# EAGLE design Motor_Driver_New_v21 (EAGLE 9.7.0)
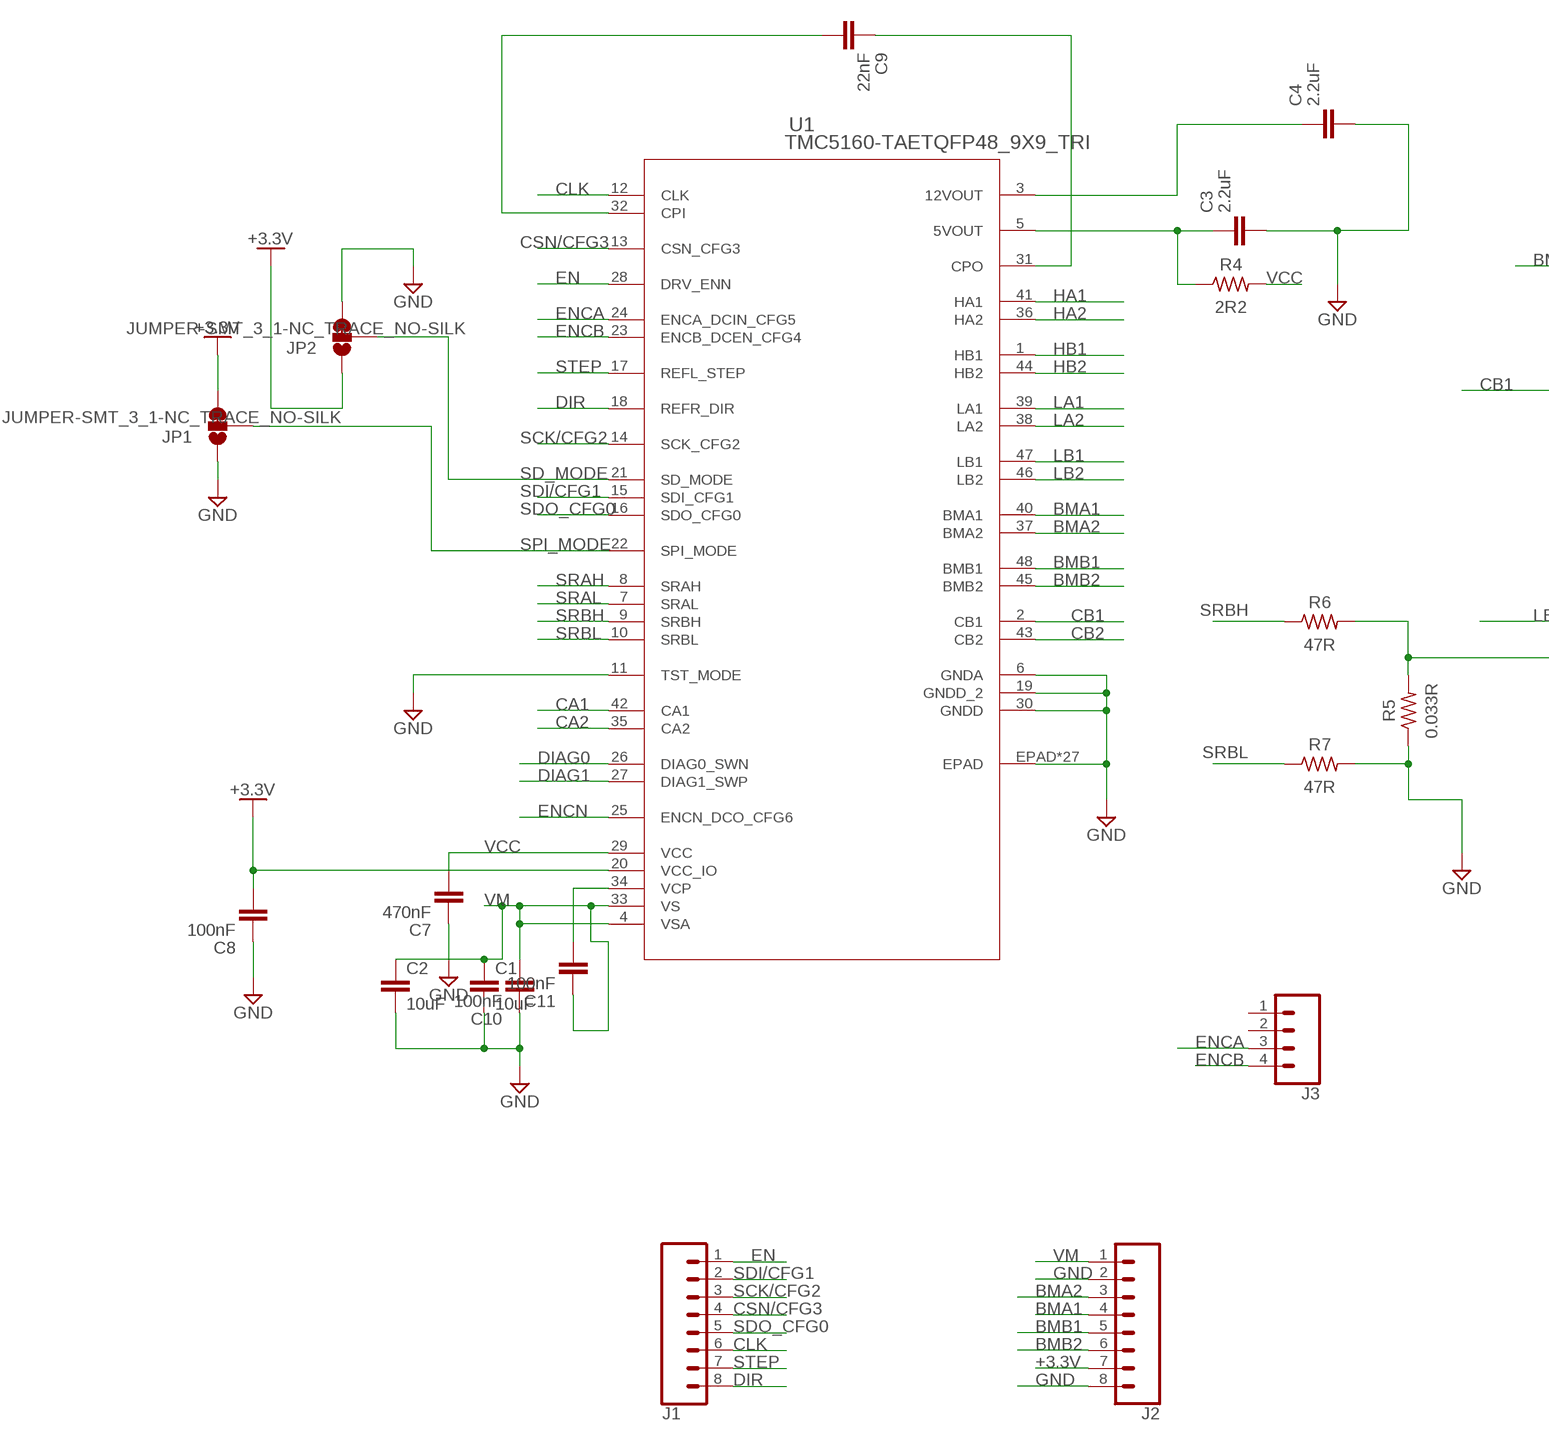
[diagram p0: schematic, sheet 1, part 1 of 2]
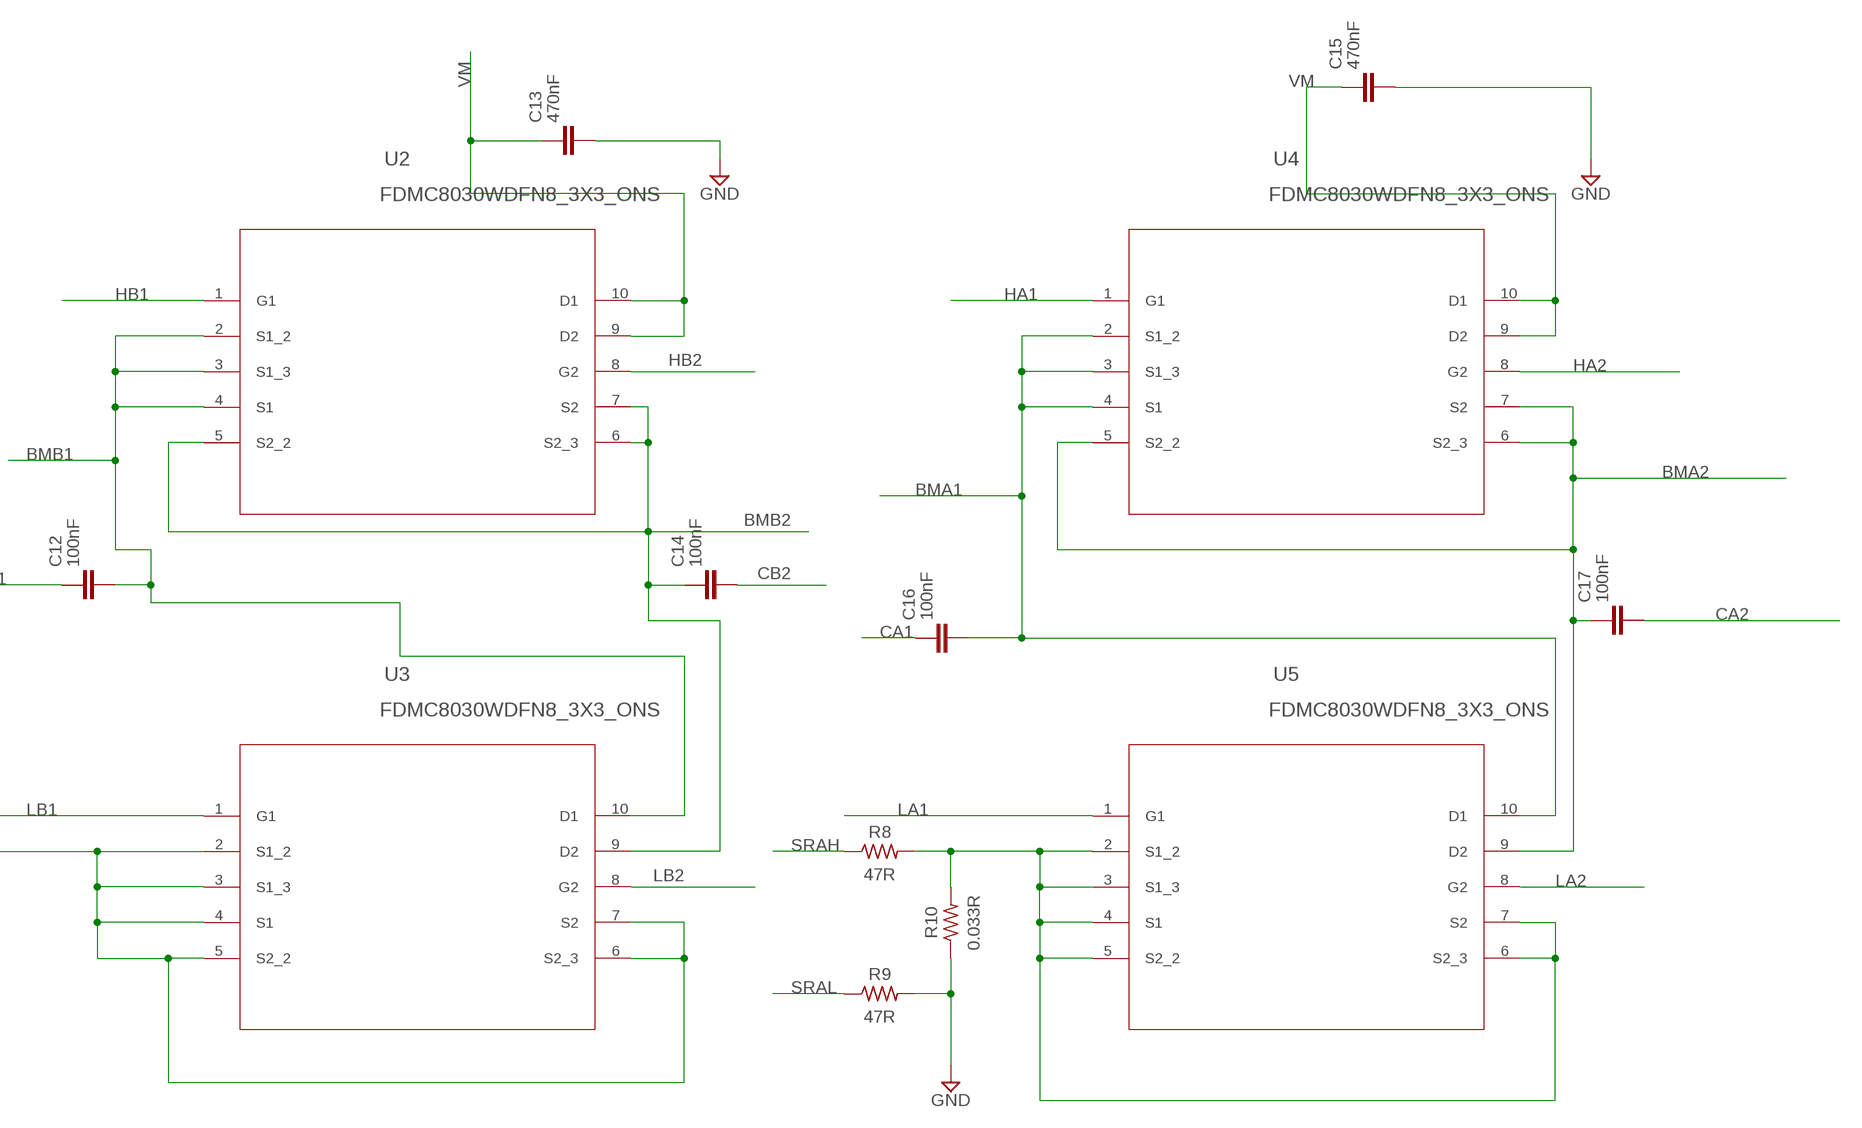
[diagram p1: schematic, sheet 1, part 2 of 2]

## Parts
C1  10uF  10UF-0805-25V-10%  [0805]
C2  10uF  10UF-0805-25V-10%  [0805]
C3  2.2uF  C_CHIP-0402(1005-METRIC)  [CAPC1005X60]
C4  2.2uF  C_CHIP-0402(1005-METRIC)  [CAPC1005X60]
C7  470nF  C_CHIP-0402(1005-METRIC)  [CAPC1005X60]
C8  100nF  C_CHIP-0402(1005-METRIC)  [CAPC1005X60]
C9  22nF  C_CHIP-0402(1005-METRIC)  [CAPC1005X60]
C10  100nF  C_CHIP-0402(1005-METRIC)  [CAPC1005X60]
C11  100nF  C_CHIP-0402(1005-METRIC)  [CAPC1005X60]
C12  100nF  C_CHIP-0402(1005-METRIC)  [CAPC1005X60]
C13  470nF  C_CHIP-0402(1005-METRIC)  [CAPC1005X60]
C14  100nF  C_CHIP-0402(1005-METRIC)  [CAPC1005X60]
C15  470nF  C_CHIP-0402(1005-METRIC)  [CAPC1005X60]
C16  100nF  C_CHIP-0402(1005-METRIC)  [CAPC1005X60]
C17  100nF  C_CHIP-0402(1005-METRIC)  [CAPC1005X60]
J1  CONN_08"  [1X08]
J2  CONN_08"  [1X08]
J3  CONN_04PTH  [1X04]
JP1  JUMPER-SMT_3_1-NC_TRACE_NO-SILK  [SMT-JUMPER_3_1-NC_TRACE_NO-SILK]
JP2  JUMPER-SMT_3_1-NC_TRACE_NO-SILK  [SMT-JUMPER_3_1-NC_TRACE_NO-SILK]
R4  2R2  R-US_CHIP-0402(1005-METRIC)  [RESC1005X40]
R5  0.033R  R-US_CHIP-1206(3216-METRIC)  [RESC3216X70]
R6  47R  R-US_CHIP-0402(1005-METRIC)  [RESC1005X40]
R7  47R  R-US_CHIP-0402(1005-METRIC)  [RESC1005X40]
R8  47R  R-US_CHIP-0402(1005-METRIC)  [RESC1005X40]
R9  47R  R-US_CHIP-0402(1005-METRIC)  [RESC1005X40]
R10  0.033R  R-US_CHIP-1206(3216-METRIC)  [RESC3216X70]
U1  TMC5160-TAETQFP48_9X9_TRI  [ETQFP48_9X9_TRI]
U2  FDMC8030WDFN8_3X3_ONS  [WDFN8_3X3_ONS]
U3  FDMC8030WDFN8_3X3_ONS  [WDFN8_3X3_ONS]
U4  FDMC8030WDFN8_3X3_ONS  [WDFN8_3X3_ONS]
U5  FDMC8030WDFN8_3X3_ONS  [WDFN8_3X3_ONS]

## Nets
+3.3V: C8.2 J2.7 JP1.3 JP2.1 U1.20(VCC_IO)
BMA1: C16.2 J2.4 U1.40(BMA1) U4.2(S1_2) U4.3(S1_3) U4.4(S1) U5.10(D1)
BMA2: C17.1 J2.3 U1.37(BMA2) U4.5(S2_2) U4.6(S2_3) U4.7(S2) U5.9(D2)
BMB1: C12.2 J2.5 U1.48(BMB1) U2.2(S1_2) U2.3(S1_3) U2.4(S1) U3.10(D1)
BMB2: C14.1 J2.6 U1.45(BMB2) U2.5(S2_2) U2.6(S2_3) U2.7(S2) U3.9(D2)
CA1: C16.1 U1.42(CA1)
CA2: C17.2 U1.35(CA2)
CB1: C12.1 U1.2(CB1)
CB2: C14.2 U1.43(CB2)
CLK: J1.6 U1.12(CLK)
CSN/CFG3: J1.4 U1.13(CSN_CFG3)
DIAG0: U1.26(DIAG0_SWN)
DIAG1: U1.27(DIAG1_SWP)
DIR: J1.8 U1.18(REFR_DIR)
EN: J1.1 U1.28(DRV_ENN)
ENCA: J3.3 U1.24(ENCA_DCIN_CFG5)
ENCB: J3.4 U1.23(ENCB_DCEN_CFG4)
ENCN: U1.25(ENCN_DCO_CFG6)
GND: C1.2 C2.2 C3.2 C4.2 C7.1 C8.1 C10.1 C13.2 C15.2 J2.2 J2.8 JP1.1 JP2.3 R5.1 R7.2 R9.2 R10.1 U1.6(GNDA) U1.11(TST_MODE) U1.19(GNDD_2) U1.30(GNDD) U1.EPAD U1.EPAD1(EPAD) U1.P$1(EPAD) U1.P$2(EPAD) U1.P$3(EPAD) U1.P$4(EPAD) U1.P$5(EPAD) U1.P$6(EPAD) U1.P$7(EPAD) U1.P$8(EPAD) U1.P$9(EPAD) U1.P$10(EPAD) U1.P$11(EPAD) U1.P$12(EPAD) U1.P$13(EPAD) U1.P$14(EPAD) U1.P$15(EPAD) U1.P$16(EPAD) U1.P$17(EPAD) U1.P$18(EPAD) U1.P$19(EPAD) U1.P$20(EPAD) U1.P$21(EPAD) U1.P$22(EPAD) U1.P$23(EPAD) U1.P$24(EPAD) U1.P$25(EPAD)
HA1: U1.41(HA1) U4.1(G1)
HA2: U1.36(HA2) U4.8(G2)
HB1: U1.1(HB1) U2.1(G1)
HB2: U1.44(HB2) U2.8(G2)
LA1: U1.39(LA1) U5.1(G1)
LA2: U1.38(LA2) U5.8(G2)
LB1: U1.47(LB1) U3.1(G1)
LB2: U1.46(LB2) U3.8(G2)
N$1: C3.1 R4.1 U1.5(5VOUT)
N$2: C4.1 U1.3(12VOUT)
N$3: C9.2 U1.32(CPI)
N$4: C9.1 U1.31(CPO)
N$6: C11.2 U1.34(VCP)
SCK/CFG2: J1.3 U1.14(SCK_CFG2)
SD_MODE: JP2.2 U1.21(SD_MODE)
SDI/CFG1: J1.2 U1.15(SDI_CFG1)
SDO_CFG0: J1.5 U1.16(SDO_CFG0)
SPI_MODE: JP1.2 U1.22(SPI_MODE)
SRAH: R8.1 U1.8(SRAH)
SRAHL: R8.2 R10.2 U5.2(S1_2) U5.3(S1_3) U5.4(S1) U5.5(S2_2) U5.6(S2_3) U5.7(S2)
SRAL: R9.1 U1.7(SRAL)
SRBH: R6.1 U1.9(SRBH)
SRBHL: R5.2 R6.2 U3.2(S1_2) U3.3(S1_3) U3.4(S1) U3.5(S2_2) U3.6(S2_3) U3.7(S2)
SRBL: R7.1 U1.10(SRBL)
STEP: J1.7 U1.17(REFL_STEP)
VCC: C7.2 R4.2 U1.29(VCC)
VM: C1.1 C2.1 C10.2 C11.1 C13.1 C15.1 J2.1 U1.4(VSA) U1.33(VS) U2.9(D2) U2.10(D1) U4.9(D2) U4.10(D1)
Unconnected: J3.1 J3.2

## Library data of the parts
C1 C2 = SparkFun-Capacitors:10UF: 10.0µF ceramic capacitors A capacitor is a passive two-terminal electrical component used to store electrical energy temporarily in an electric field.; PROD_ID: CAP-14259
C3 C4 C7-C17 = Capacitor:C: Capacitor - Generic; CATEGORY: Capacitor
J1 J2 = SparkFun-Connectors:CONN_08: Multi connection point. Often used as Generic Header-pin footprint for 0.1 inch spaced/style header connections On any of the 0.1 inch spaced packages, you can populate with these: Break Away Headers - Straight <https://www.sparkfun.com/products/116> (PRT-00116) Break Away Male Headers - Right Angle <https://www.sparkfun.com/products/553> (PRT-00553) Female Headers <https://www.sparkfun.com/products/115> (PRT-00115) Break Away Headers - Machine Pin <https://www.sparkfun.com/products/117> (PRT-00117) Break Away Female Headers - Swiss Machine Pin <https://www.sparkfun.com/products/743> (PRT-00743) Arduino Stackable Header - 8 Pin <https://www.sparkfun.com/products/9279> (PRT-09279) For SCREWTERMINALS and SPRING TERMINALS visit here: Screw Terimnals on SparkFun.com <https://www.sparkfun.com/search/results?term=Screw+Terminals> (5mm/3.5mm/2.54mm spacing) This device is also useful as a general connection point to wire up your design to another part of your project. Our various solder wires solder well into these plated through hole pads. Hook-Up Wire - Assortment (Stranded, 22 AWG) <https://www.sparkfun.com/products/11375> (PRT-11375) Hook-Up Wire - Assortment (Solid Core, 22 AWG) <https://www.sparkfun.com/products/11367> (PRT-11367) View the entire wire category on our website here <https://www.sparkfun.com/categories/141> Special notes: Molex polarized connector foot print use with SKU : PRT-08231 with associated crimp pins and housings. 1MM SMD Version SKU: PRT-10208 NOTES ON THE VARIANTS LOCK and LOCK_LONGPADS... This footprint was designed to help hold the alignment of a through-hole component (i.e. 6-pin header) while soldering it into place. You may notice that each hole has been shifted either up or down by 0.005 of an inch from it's more standard position (which is a perfectly straight line). This slight alteration caused the pins (the squares in the middle) to touch the edges of the holes. Because they are alternating, it causes a "brace" to hold the component in place. 0.005 has proven to be the perfect amount of "off-center" position when using our standard breakaway headers. Although looks a little odd when you look at the bare footprint, once you have a header in there, the alteration is very hard to notice. Also,if you push a header all the way into place, it is covered up entirely on the bottom side.; PROD_ID: CONN-08438
J3 = SparkFun-Connectors:CONN_04: Multi connection point. Often used as Generic Header-pin footprint for 0.1 inch spaced/style header connections On any of the 0.1 inch spaced packages, you can populate with these: Break Away Headers - Straight <https://www.sparkfun.com/products/116> (PRT-00116) Break Away Male Headers - Right Angle <https://www.sparkfun.com/products/553> (PRT-00553) Female Headers <https://www.sparkfun.com/products/115> (PRT-00115) Break Away Headers - Machine Pin <https://www.sparkfun.com/products/117> (PRT-00117) Break Away Female Headers - Swiss Machine Pin <https://www.sparkfun.com/products/743> (PRT-00743) For SCREWTERMINALS and SPRING TERMINALS visit here: Screw Terimnals on SparkFun.com <https://www.sparkfun.com/search/results?term=Screw+Terminals> (5mm/3.5mm/2.54mm spacing) This device is also useful as a general connection point to wire up your design to another part of your project. Our various solder wires solder well into these plated through hole pads. Hook-Up Wire - Assortment (Stranded, 22 AWG) <https://www.sparkfun.com/products/11375> (PRT-11375) Hook-Up Wire - Assortment (Solid Core, 22 AWG) <https://www.sparkfun.com/products/11367> (PRT-11367) View the entire wire category on our website here <https://www.sparkfun.com/categories/141> Special notes: Molex polarized connector foot print use with SKU : PRT-08231 with associated crimp pins and housings. 1MM SMD Version SKU: PRT-10208; PROD_ID: CONN-09696
JP1 JP2 = SparkFun-Jumpers:JUMPER-SMT_3_1-NC_TRACE: Normally closed trace jumper (1 of 2 connections) This jumper has a trace between two pads so it's normally closed (NC). The other connection is normally open (NO). Use a razor knife to open the connection. For best results follow the IPC guidelines for cutting traces: Cutout at least 0.063 mm (0.005 in). Remove all loose material to clean up the cut area. Seal the cut with an approved epoxy. Reapply solder to reclose the connection, or to close the NO connection.
R4-R10 = Resistor:R-US: Resistor Fixed - ANSI; CATEGORY: Resistor; SUB-CATEGORY: Fixed
U1 = Library:TMC5160-TA; COPYRIGHT: Copyright (C) 2023 Ultra Librarian. All rights reserved.; MANUFACTURER_PART_NUMBER: TMC5160-TA; MFR_NAME: Analog Devices Inc
U2-U5 = fdmc8030lib:FDMC8030; COPYRIGHT: Copyright (C) 2023 Ultra Librarian. All rights reserved.; MANUFACTURER_PART_NUMBER: FDMC8030; MFR_NAME: onsemi

## Board
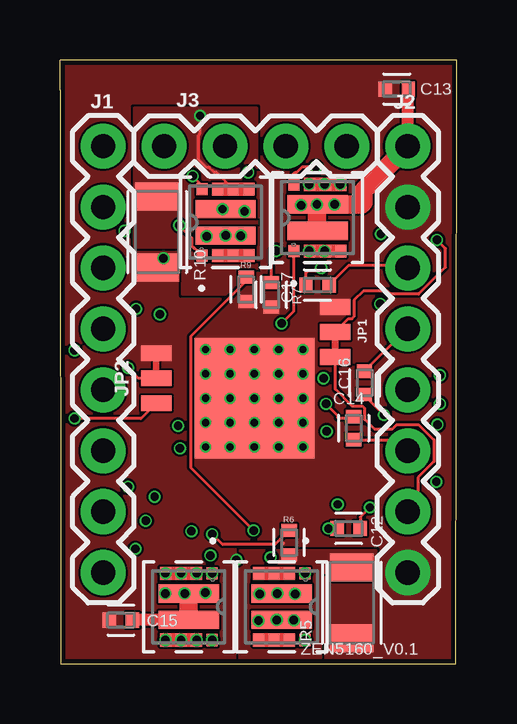
[diagram p2: board, top side]
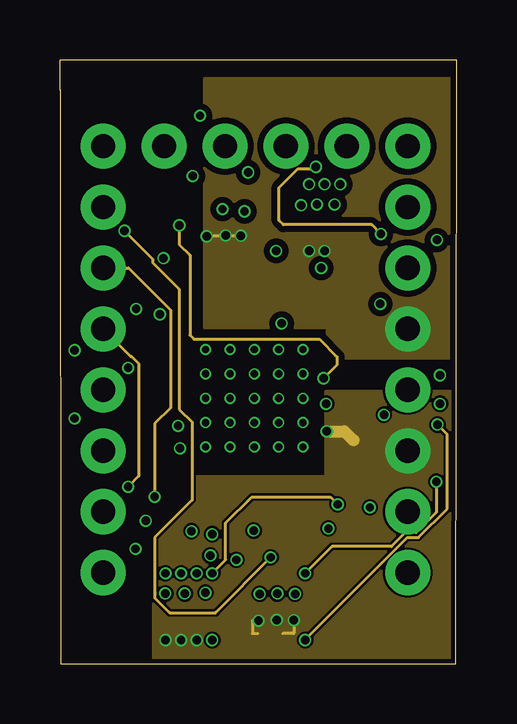
[diagram p3: board, inner layer Route2]
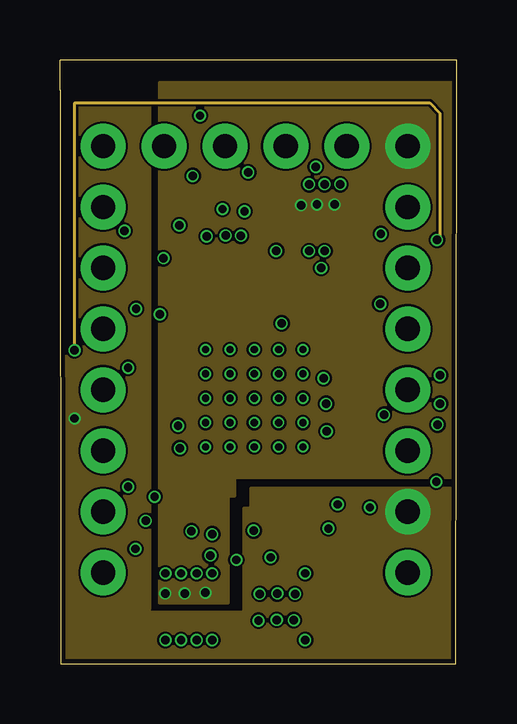
[diagram p4: board, inner layer Route3]
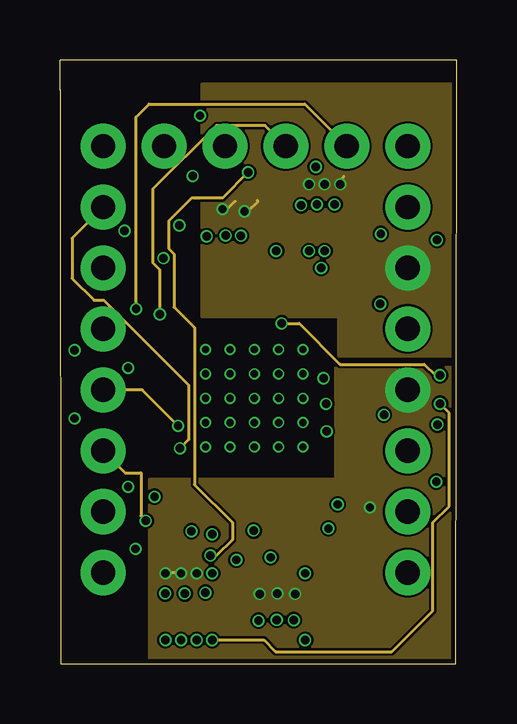
[diagram p5: board, inner layer Route14]
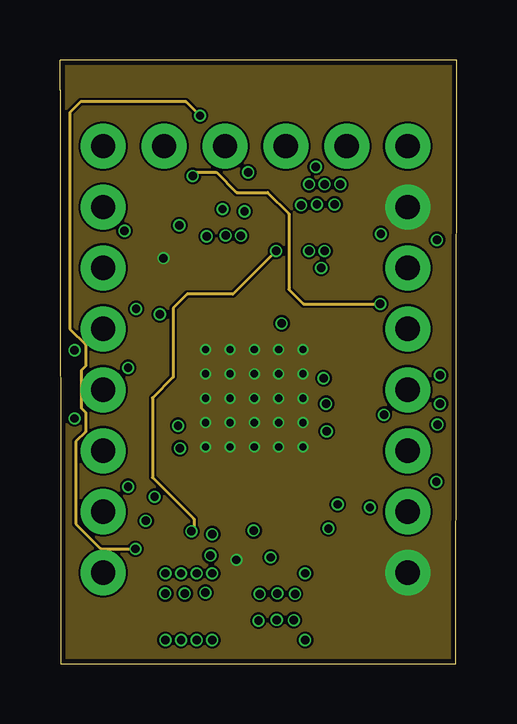
[diagram p6: board, inner layer Route15]
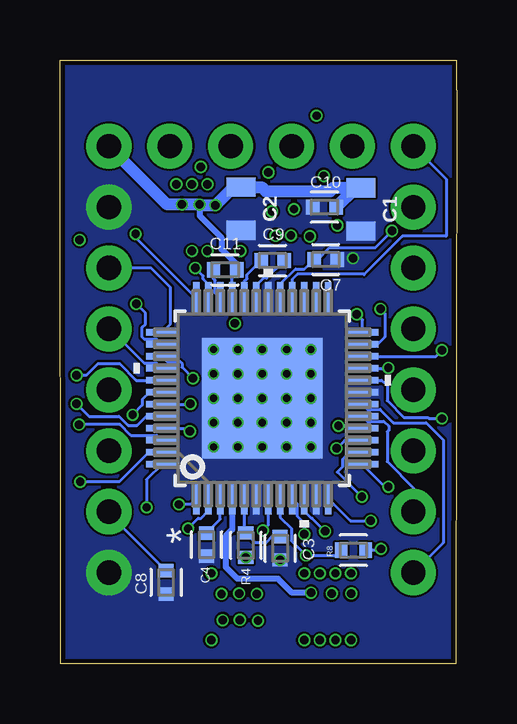
[diagram p7: board, bottom side, seen from below]

Size 16.54 x 25.18 mm. Coordinates in mm from the lower left corner, seen from the top.
Outline: 0.03,0 16.52,0 16.54,23.91 16.54,25.18 0,25.18 0,23.91 0.03,0
Copper layers (1+2*3+14*15+16): Top 0.035mm / dielectric 0.1mm / Route2 0.0175mm / dielectric 0.565mm / Route3 0.0175mm / dielectric 5mil / Route14 0.0356mm / dielectric 0.1499mm / Route15 0.01778125mm / dielectric 0.17018125mm / Bottom 0.035mm
Design rules "jlcpcb-6-layer *": minimum track width 3.5mil, minimum drill 0.2mm, track to track 3.5mil, track to pad 3.5mil, pad to pad 3.5mil, via to via 5mil, smd to smd 0mil, copper to edge 0.2mm, drill to drill 5mil, minimum pad ring 3mil, minimum via ring 3mil, stop-mask expansion 0mil, vias tented up to drill 100mil, thermal gap 10mil

### Footprints (pad centres in the part's own frame; a part is rotated, then mirrored left to right if it is on the bottom)
0805 = smd 0.8 x 1.2: 1 -0.9,0; 2 0.9,0
CAPC1005X60 = smd 0.56 x 0.629: 1 -0.485,0; 2 0.485,0
1X08 = drill 1.016 pad 1.88: 1 0,0; 2 2.54,0; 3 5.08,0; 4 7.62,0; 5 10.16,0; 6 12.7,0; 7 15.24,0; 8 17.78,0
1X04 = drill 1.016 pad 1.88: 1 0,0; 2 2.54,0; 3 5.08,0; 4 7.62,0
SMT-JUMPER_3_1-NC_TRACE_NO-SILK = smd 0.66 x 1.27: 1 -1.041,0; 2 0,0; 3 1.041,0
RESC1005X40 = smd 0.535 x 0.644: 1 -0.507,0; 2 0.507,0
RESC3216X70 = smd 1.165 x 1.815: 1 -1.475,0; 2 1.475,0
ETQFP48_9X9_TRI = smd 1.346 x 0.279: 1 -4.178,2.75; 2 -4.178,2.25; 3 -4.178,1.75; 4 -4.178,1.25; 5 -4.178,0.75; 6 -4.178,0.25; 7 -4.178,-0.25; 8 -4.178,-0.75; 9 -4.178,-1.25; 10 -4.178,-1.75; 11 -4.178,-2.25; 12 -4.178,-2.75; 25 4.178,-2.75; 26 4.178,-2.25; 27 4.178,-1.75; 28 4.178,-1.25; 29 4.178,-0.75; 30 4.178,-0.25; 31 4.178,0.25; 32 4.178,0.75; 33 4.178,1.25; 34 4.178,1.75; 35 4.178,2.25; 36 4.178,2.75 | smd 0.279 x 1.346: 13 -2.75,-4.178; 14 -2.25,-4.178; 15 -1.75,-4.178; 16 -1.25,-4.178; 17 -0.75,-4.178; 18 -0.25,-4.178; 19 0.25,-4.178; 20 0.75,-4.178; 21 1.25,-4.178; 22 1.75,-4.178; 23 2.25,-4.178; 24 2.75,-4.178; 37 2.75,4.178; 38 2.25,4.178; 39 1.75,4.178; 40 1.25,4.178; 41 0.75,4.178; 42 0.25,4.178; 43 -0.25,4.178; 44 -0.75,4.178; 45 -1.25,4.178; 46 -1.75,4.178; 47 -2.25,4.178; 48 -2.75,4.178 | smd 5.004 x 5.004: EPAD 0,0 | smd 5.004 x 5.004 bottom: EPAD1 0,0 | drill 0.305: P$1 -2.032,2.032; P$2 -1.016,2.032; P$3 0,2.032; P$4 1.016,2.032; P$5 2.032,2.032; P$6 -2.032,1.016; P$7 -2.032,0; P$8 -2.032,-1.016; P$9 -2.032,-2.032; P$10 -1.016,1.016; P$11 -1.016,0; P$12 -1.016,-1.016; P$13 -1.016,-2.032; P$14 0,1.016; P$15 0,0; P$16 0,-1.016; P$17 0,-2.032; P$18 1.016,1.016; P$19 1.016,0; P$20 1.016,-1.016; P$21 1.016,-2.032; P$22 2.032,1.016; P$23 2.032,0; P$24 2.032,-1.016; P$25 2.032,-2.032
WDFN8_3X3_ONS = smd 0.508 x 0.457: 1 -1.39,0.98; 2 -1.39,0.33; 3 -1.39,-0.32; 4 -1.39,-0.97; 5 1.39,-0.97; 6 1.39,-0.32; 7 1.39,0.33; 8 1.39,0.98 | smd 0.762 x 2.515: 9 0.55,0; 10 -0.55,0

### Placement (x,y rotation side)
C1  3.99,18.95 270 bottom
C2  8.99,18.98 270 bottom
C3  7.36,4.83 270 bottom
C4  10.43,4.98 270 bottom
C7  5.46,16.87 180 bottom
C8  12.12,3.4 90 bottom
C9  7.67,16.82 180 bottom
C10  5.51,19.05 0 bottom
C11  9.65,16.43 180 bottom
C12  12.04,5.65 0 top
C13  14.05,23.97 180 top
C14  12.25,9.83 90 top
C15  2.54,1.83 180 top
C16  12.7,11.72 90 top
C17  10.74,15.8 180 top
J1  1.8,21.59 270 top
J2  14.5,21.59 270 top
J3  4.34,21.59 0 top
JP1  11.48,13.84 270 top
JP2  4.01,11.91 90 top
R4  8.79,4.95 270 bottom
R5  12.16,2.55 90 top
R6  9.56,5.06 270 top
R7  8.81,15.39 270 top
R8  4.3,4.75 0 bottom
R9  7.76,15.62 270 top
R10  4.05,18.01 90 top
U1  8.11,11.08 90 bottom
U2  5.37,2.39 270 top
U3  9.25,2.39 270 top
U4  10.74,18.61 90 top
U5  6.91,18.41 90 top

### Tracks (layer width: path | path; a pad name or v marks a point on that pad's centre or on a via)
+3.3V  (via drill 0.35)
  Top 0.127: JP2.1 3.38,10.24 v0.61,10.24 | J2.7 14.94,6.78 14.94,7.78 15.6,8.44 15.6,9.34 14.96,9.98 14.05,9.98 13.87,9.8 13.11,9.8 12.72,10.19 12.72,10.66 12.63,10.75 12.19,10.75 11.48,11.46 JP1.3
  Route3 0.127: v0.61,10.24 0.53,10.16 0.41,10.16
  Bottom 0.127: U1.20 3.12,11.83 2.9,11.61 2.9,10.98 2.19,10.27 1.18,10.27 1.14,10.24 v0.61,10.24 | C8.2 14.5,6.28 J2.7
  pour Route3 (no thermals): 7.64,2.17 7.61,2.16 3.77,2.16 3.74,2.17 3.72,2.19 3.71,2.22 3.71,2.25 3.72,2.28 3.73,2.29 3.73,25.37 -0.76,25.37 -0.76,-1.27 16.89,-1.27 16.89,7.32 7.98,7.32 7.98,6.54 7.96,6.51 7.94,6.49 7.91,6.48 7.67,6.48 7.67,2.22 7.66,2.19
BMA1  (via drill 0.35)
  Top 0.127: U5.10 6.16,17.86 v6.12,17.83 | J2.4 14.47,13.97 C16.2
  Top 0.152: U4.2 v11.04,17.22 U4.4 | U4.3 v10.39,17.22
  Route2 0.127: v10.39,17.22 | U5.10 6.84,17.86 6.76,17.78 6.81,17.73 | U5.10 7.54,17.86 v7.54,17.86 | v6.12,17.83 6.87,17.83 U5.10
  Bottom 0.127: U1.40 12.49,12.54 13.02,12.54 14.45,13.97 J2.4
  other vias: 6.91,17.86
  pour Route2 (isolate 0.254, no thermals): 6.01,24.4 6.01,14.03 11.09,14.03 11.11,14.02 11.13,14.01 11.14,13.98 11.14,12.76 16.85,12.76 16.85,24.4
BMA2  (via drill 0.35)
  Top 0.127: U4.6 v11.69,20 | v7.7,18.87 7.6,18.96 U5.9 v6.78,18.96 | C17.1 12.04,16.61 14.4,16.61 J2.3
  Top 0.152: v10.39,20 v11.04,20 U4.6 | U4.7 U4.6 | U4.6 U4.5
  Route14 0.127: v11.69,20 11.69,20.17 11.84,20.32 | v6.78,18.96 v6.79,18.96 6.88,18.87 7.3,19.29 | v7.7,18.87 7.85,18.87 8.23,19.25 8.23,19.33
  Bottom 0.127: U1.37 11.94,14.18 11.94,15.7 12.75,16.51 J2.3
  pour Route14 (no thermals): 5.91,24.17 5.91,14.49 11.57,14.49 11.59,14.48 11.61,14.46 11.62,14.44 11.62,12.84 16.8,12.84 16.8,24.17
BMB1  (via drill 0.35)
  Top 0.127: v8.33,2.92 8.33,2.94 v9.07,2.94 U3.10 9.8,2.94 v9.8,2.92 | U2.4 U2.3 U2.2 | v12.93,6.53 12.52,6.12 C12.2
  Route14 0.127: U2.4 4.4,3.81 4.9,3.81 4.9,3.79
  Bottom 0.127: U1.48 12.93,7.68 v12.93,6.53
  other vias: 4.4,3.78 5.05,3.78 5.7,3.78
  pour Route14 (no thermals): 11.49,7.73 11.47,7.71 11.45,7.7 3.73,7.7 3.73,-1.19 16.84,-1.19 16.84,12.37 11.51,12.37 11.51,7.76
BMB2  (via drill 0.35)
  Top 0.127: v8.28,1.8 8.28,1.84 v9.04,1.84 U3.9 v9.75,1.84 v9.75,1.83 | U2.5 U2.6 U2.7 | C14.1 14.05,9.34 J2.6
  Route2 0.127: v8.28,1.8 8.03,1.8 8.03,1.27 8.26,1.27 | v9.75,1.83 9.75,1.27 9.3,1.27
  Route2 0.508: v11.13,9.7 11.86,9.7 12.24,9.32
  Bottom 0.127: U1.45 11.25,9.83 v11.13,9.7
  other vias: 4.4,1 5.05,1 5.7,1
  pour Route2 (no thermals): 11.09,7.83 11.07,7.81 11.04,7.8 3.91,7.8 3.91,-1.09 16.84,-1.09 16.84,11.35 11.1,11.35 11.1,7.86
CA1  (via drill 0.35)
  Top 0.127: v13.51,10.39 12.7,11.2 C16.1
  Bottom 0.127: v13.51,10.39 13.11,10.79 13.11,11.03 12.81,11.33 U1.42
CA2  (via drill 0.35)
  Top 0.127: v10.9,16.51 10.8,16.41 10.36,16.41 10.26,16.3 C17.2
  Bottom 0.127: v10.9,16.51 10.57,16.18 10.57,16.06 10.36,15.84 U1.35
CB1  (via drill 0.35)
  Top 0.152: C12.1 v11.2,5.65
  Bottom 0.127: v11.2,5.65 10.77,6.08 10.65,6.08 10.36,6.37 U1.2
CB2  (via drill 0.35)
  Top 0.127: v11.1,10.85 11.58,10.36 11.58,10.26 12.2,10.26 C14.2
  Bottom 0.127: U1.43 11.12,10.83 v11.1,10.85
CLK  (via drill 0.35)
  Route14 0.127: J1.6 2.72,7.98 3.38,7.98 3.38,6.17 v3.58,5.97
  Bottom 0.127: U1.12 4.43,5.97 v3.58,5.97
CSN/CFG3  (via drill 0.35)
  Route2 0.127: J1.4 2.95,12.83 2.99,12.83 3.29,12.53 3.29,7.83 v2.84,7.39
  Bottom 0.127: U1.13 2.99,7.39 v2.84,7.39
DIR
  Bottom 0.127: U1.18 3.72,10.62 3.19,10.62 2.63,10.06 1.27,10.06 0.56,9.35 0.56,5.05 J1.8
EN
  Bottom 0.127: U1.28 6.86,16.03 6.63,16.26 3.89,16.26 3.86,16.23 2.26,17.83 0.43,17.83 0.43,20.22 J1.1
ENCA  (via drill 0.35)
  Route14 0.127: v4.17,14.58 4.17,16.44 3.87,16.73 3.87,19.8 6.53,22.45 8.56,22.45 J3.3
  Bottom 0.127: U1.24 3.93,14.34 v4.17,14.58
ENCB  (via drill 0.35)
  Route14 0.127: v3.18,14.81 3.18,22.81 3.71,23.34 10.21,23.34 J3.4
  Bottom 0.127: U1.23 3.31,13.33 3,13.64 3,14.63 v3.18,14.81
GND  (via drill 0.35)
  Top 0.127: 9.33,5.04 9.31,5.01 | 4.18,16.43 4.32,16.57 v4.32,16.92
  other vias: 7.36,4.34
  pour Top (rank 5, no thermals): -0.8,-1.21 18.12,-1.21 18.12,25.34 -0.8,25.34
  pour Route15 (no thermals): -0.79,-1.19 18.11,-1.19 18.11,25.32 -0.79,25.32
  pour Bottom (no thermals): -0.8,-1.21 18.12,-1.21 18.12,25.34 -0.8,25.34
HA1  (via drill 0.35)
  Top 0.127: 9.74,17.22 9.74,14.69 v9.25,14.2
  Top 0.152: U4.1 9.74,17.22
  Route14 0.127: v9.25,14.2 9.98,14.2 11.68,12.5 15.19,12.5 15.65,12.04 v15.85,12.04
  Bottom 0.127: U1.41 13.36,11.83 14.05,12.52 14.96,12.52 15.44,12.04 v15.85,12.04
HA2  (via drill 0.35)
  Top 0.127: 9.74,20 9.74,20.43 9.8,20.5 9.88,20.5 10.1,20.73 v10.67,20.73
  Top 0.152: U4.8 9.74,20
  Route2 0.127: v13.39,17.93 13,18.31 9.32,18.31 9.14,18.49 9.14,19.86 9.93,20.65 10.59,20.65 v10.67,20.73
  Bottom 0.127: U1.36 13.39,17.79 v13.39,17.93
HB1  (via drill 0.35)
  Route2 0.127: v11.58,6.66 11.28,6.96 8,6.96 6.92,5.88 6.92,4.34 U2.1
  Bottom 0.127: U1.1 11.1,6.66 v11.58,6.66
  other vias: 6.35,3.78
HB2  (via drill 0.35)
  Route14 0.127: U2.8 8.5,1 8.99,0.51 13.84,0.51 15.54,2.21 15.54,5.89 16.23,6.58 16.23,10.46 v15.85,10.85
  Bottom 0.127: v15.85,10.85 15.33,10.33 14.08,10.33 13.7,9.95 13.33,9.95 12.95,10.33 U1.44
  other vias: 6.35,1
LA1  (via drill 0.35)
  Top 0.127: U5.1 5.62,17.33 5.59,17.33 5.5,17.42 5.5,17.77 v4.98,18.29
  Route2 0.127: v4.98,18.29 4.98,17.49 5.42,17.05 5.42,13.71 5.59,13.54 10.82,13.54 11.56,12.8 11.56,12.47 v11,11.91
  Bottom 0.127: U1.39 12.08,12.62 11.55,12.62 11.46,12.53 11.46,12.37 v11,11.91
LA2  (via drill 0.35)
  Top 0.127: U5.8 5.93,19.95 v5.54,20.34
  Route15 0.127: v13.36,15.01 10.16,15.01 9.55,15.62 9.55,18.77 8.66,19.66 7.37,19.66 6.53,20.5 5.69,20.5 v5.54,20.34
  Bottom 0.127: U1.38 12.49,13.54 13.02,13.54 13.11,13.63 13.11,14.03 12.98,14.16 12.98,14.63 v13.36,15.01
LB1  (via drill 0.35)
  Route2 0.127: U3.1 11.35,4.9 13.82,4.9 14.41,5.49 14.86,5.49 15.7,6.32 v15.7,7.59
  Bottom 0.127: U1.47 12.84,8.83 14.07,7.59 v15.7,7.59
  other vias: 10.23,3.78
LB2  (via drill 0.35)
  Route2 0.127: U3.8 14.5,5.27 14.95,5.27 16.15,6.47 16.15,9.58 v15.75,9.98
  Bottom 0.127: U1.46 12.49,9.54 13.59,9.54 14.04,9.98 v15.75,9.98
  other vias: 10.23,1
N$1
  Bottom 0.127: U1.5 8.86,5.53 R4.1 8.41,5.08 7.92,5.08 7.69,5.31 C3.1
N$2
  Bottom 0.127: U1.3 9.86,6.03 C4.1
N$3
  Bottom 0.127: C9.2 8.74,16.24 8.74,16.06 8.86,15.94 U1.32
N$4
  Bottom 0.127: C9.1 7.93,16.08 8.06,16.08 8.36,15.79 U1.31
N$6
  Bottom 0.127: C11.2 10.14,16.07 10.06,15.99 10.06,15.46 U1.34
SCK/CFG2  (via drill 0.35)
  Route2 0.127: v3.95,6.97 3.95,10.02 4.61,10.68 4.61,14.76 2.86,16.51 J1.3
  Bottom 0.127: U1.14 4.46,8.83 4.75,8.53 4.75,8.23 4.98,8 v3.95,6.97
SD_MODE  (via drill 0.35)
  Top 0.127: JP2.2 3.28,11.91 v2.84,12.34
  Bottom 0.127: U1.21 2.86,12.33 v2.84,12.34
SDI/CFG1  (via drill 0.35)
  Route14 0.127: J1.2 0.51,17.75 0.51,16.08 1.42,15.16 1.83,15.16 5.37,11.62 5.37,9.36 v5,8.99
  Bottom 0.127: U1.15 4.67,9.33 v5,8.99
SDO_CFG0  (via drill 0.35)
  Route14 0.127: v4.93,9.93 3.43,11.43 J1.5
  Bottom 0.127: U1.16 4.03,9.93 v4.93,9.93
SPI_MODE  (via drill 0.35)
  Top 0.127: v15.72,17.68 16.08,17.32 16.08,16.54 14.96,15.42 13.79,15.42 13.67,15.54 12.65,15.54 12.27,15.16 12.27,14.49 12.18,14.4 12.04,14.4 JP1.2
  Route3 0.127: v0.61,13.08 0.61,23.37 0.64,23.39 15.42,23.39 15.85,22.96 15.85,17.8 v15.72,17.68
  Bottom 0.127: U1.22 0.86,12.83 v0.61,13.08
SRAH  (via drill 0.35)
  Route14 0.127: v7.85,20.5 6.78,19.43 5.5,19.43 4.54,18.47 4.54,17.32 4.76,17.1 4.76,14.88 5.61,14.02 5.61,7.47 7.19,5.89 7.19,5.18 6.53,4.52 v6.27,4.52
  Bottom 0.127: U1.8 7.36,6.12 6.89,5.65 6.89,5.14 v6.27,4.52 5.04,4.52 R8.1
SRAHL  (via drill 0.35)
  Top 0.127: 7.28,19.85 U5.6 6.54,20.5 6.43,20.5 6.23,20.7 6.12,20.7 5.79,21.03 5.79,22.04 5.84,22.09 v5.84,22.86
  Route15 0.127: v5.84,22.86 5.26,23.44 0.86,23.44 0.41,22.99 0.41,13.97 1.07,13.31 1.07,12.42 0.89,12.24 0.89,10.67 1.07,10.49 1.07,9.68 0.66,9.27 0.66,5.84 1.7,4.8 v3.15,4.8
  Bottom 0.127: v3.15,4.8 3.2,4.75 R8.2
  pour Top (no thermals): 3.12,23.16 3.12,17.37 5.04,17.37 5.07,17.36 5.09,17.34 5.11,17.31 5.11,15.42 8.2,15.42 8.2,23.16
SRAL  (via drill 0.35)
  Top 0.127: R9.1 7.76,15.96 5.45,13.64 5.45,8.19 v8.08,5.56
  Bottom 0.127: U1.7 7.86,5.78 v8.08,5.56
SRBH  (via drill 0.35)
  Top 0.127: R6.1 8.97,4.98 6.78,4.98 v6.35,5.41
  Bottom 0.127: U1.9 6.65,6.69 6.65,6.16 6.35,5.87 v6.35,5.41
SRBHL
  pour Top (no thermals): 7.52,-0.36 10.87,-0.36 10.87,3.75 10.88,3.78 10.9,3.8 10.93,3.81 13.18,3.81 13.18,4.72 7.52,4.72
SRBL  (via drill 0.35)
  Top 0.127: v9.02,17.22 8.81,17.02 R7.1
  Route15 0.127: v9.02,17.22 7.21,15.42 5.31,15.42 4.72,14.83 4.72,11.96 3.86,11.1 3.86,7.77 5.59,6.04 5.59,5.64 v5.49,5.54
  Bottom 0.127: v5.49,5.54 6.02,6.08 6.06,6.08 6.36,6.37 U1.10
STEP
  Bottom 0.127: U1.17 3.72,10.12 3.04,10.12 2.83,9.92 2.83,9.74 2.9,9.68 2.9,8.44 1.8,7.34 J1.7
VCC  (via drill 0.35)
  Route2 0.127: R4.2 6.5,2.16 6.5,2.13 4.57,2.13 3.95,2.75 3.95,5.27 5.51,6.83 5.51,7.44 5.51,7.62 5.51,10.08 4.98,10.62 4.98,15.63 3.87,16.73 3.87,16.88 v2.69,18.06
  Bottom 0.127: U1.29 7.36,15.84 6.72,16.47 6.34,16.47 C7.2 5.79,16.87 5.29,17.36 3.39,17.36 v2.69,18.06
  other vias: 8.79,4.45
VM  (via drill 0.35)
  Top 0.127: v4.39,2.94 v5.21,2.94 U2.10 6.07,2.94 v6.07,2.97 | v11.46,19.16 v10.72,19.16
  Top 0.152: v10.06,19.13 10.71,19.13 U4.9 v11.46,19.16 | U4.10 10.72,18.06
  Top 0.508: U2.9 C15.1 | J2.1 14.5,23.97 C13.1
  Top 0.762: U2.10 U2.9 | J2.1 12.65,19.74 12.65,19.23 12.58,19.16 v11.46,19.16 | v10.72,19.16 10.72,18.06
  Route3 0.127: v6.07,2.97 6.07,2.95 | v10.06,19.13 10.11,19.13 | v10.72,19.16 10.61,19.05 10.57,19.05
  Bottom 0.127: C11.1 9.36,16.25 U1.33
  Bottom 0.254: v10.72,19.16 10.72,18.7 9.81,17.78 9.81,17.3 9.17,16.66 C11.1 | U1.4 9.36,5.6 9.63,5.33 9.63,4.04 9.14,3.56 7.44,3.56 6.86,2.97 v6.07,2.97
  Bottom 0.508: J2.1 12.07,19.16 v11.46,19.16 v10.72,19.16 10.72,19.13 v10.06,19.13 9.3,19.88 C2.1 8.13,19.88 7.96,19.71 5.28,19.71 5.14,19.85 C1.1 4.23,19.85 C10.2
  pour Route3 (no thermals): 4.17,2.54 7.01,2.54 7.01,6.95 7.02,6.98 7.04,7 7.07,7.01 7.29,7.01 7.29,7.71 7.3,7.74 7.32,7.76 7.35,7.77 17.07,7.77 17.07,24.23 4.17,24.23

### Text on the board
tPlace: ZEN5160_V0.1